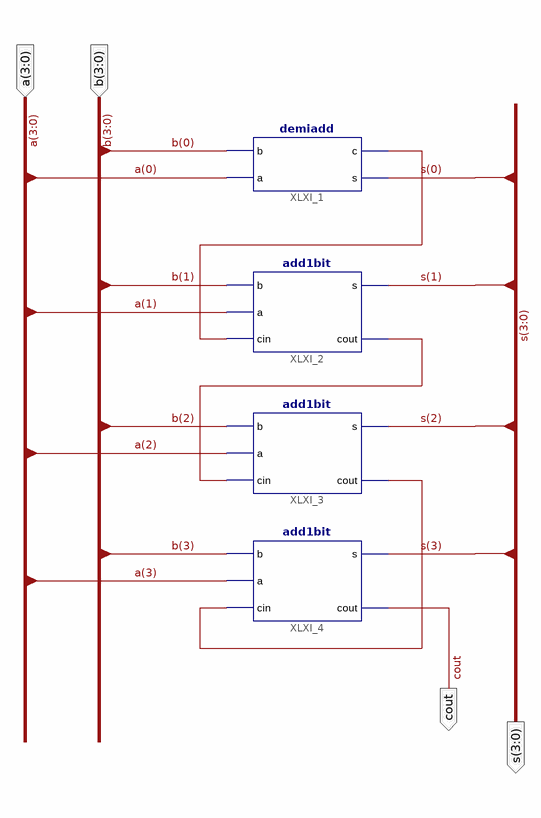
[diagram p0: schematic sheet 1]
// Xilinx ISE schematic add4bit.sch (spartan3e) as structural Verilog: 4 symbols, 4 ports
module add4bit (
  input  [3:0] a,
  input  [3:0] b,
  output [3:0] s,
  output cout
);

  wire XLXN_19, XLXN_20, XLXN_21;

  demiadd XLXI_1 (.b(b[0]), .a(a[0]), .c(XLXN_19), .s(s[0]));
  add1bit XLXI_2 (.b(b[1]), .a(a[1]), .cin(XLXN_19), .s(s[1]), .cout(XLXN_20));
  add1bit XLXI_3 (.b(b[2]), .a(a[2]), .cin(XLXN_20), .s(s[2]), .cout(XLXN_21));
  add1bit XLXI_4 (.b(b[3]), .a(a[3]), .cin(XLXN_21), .s(s[3]), .cout(cout));
endmodule
